# EAGLE schematic jayday (EAGLE 6.2)
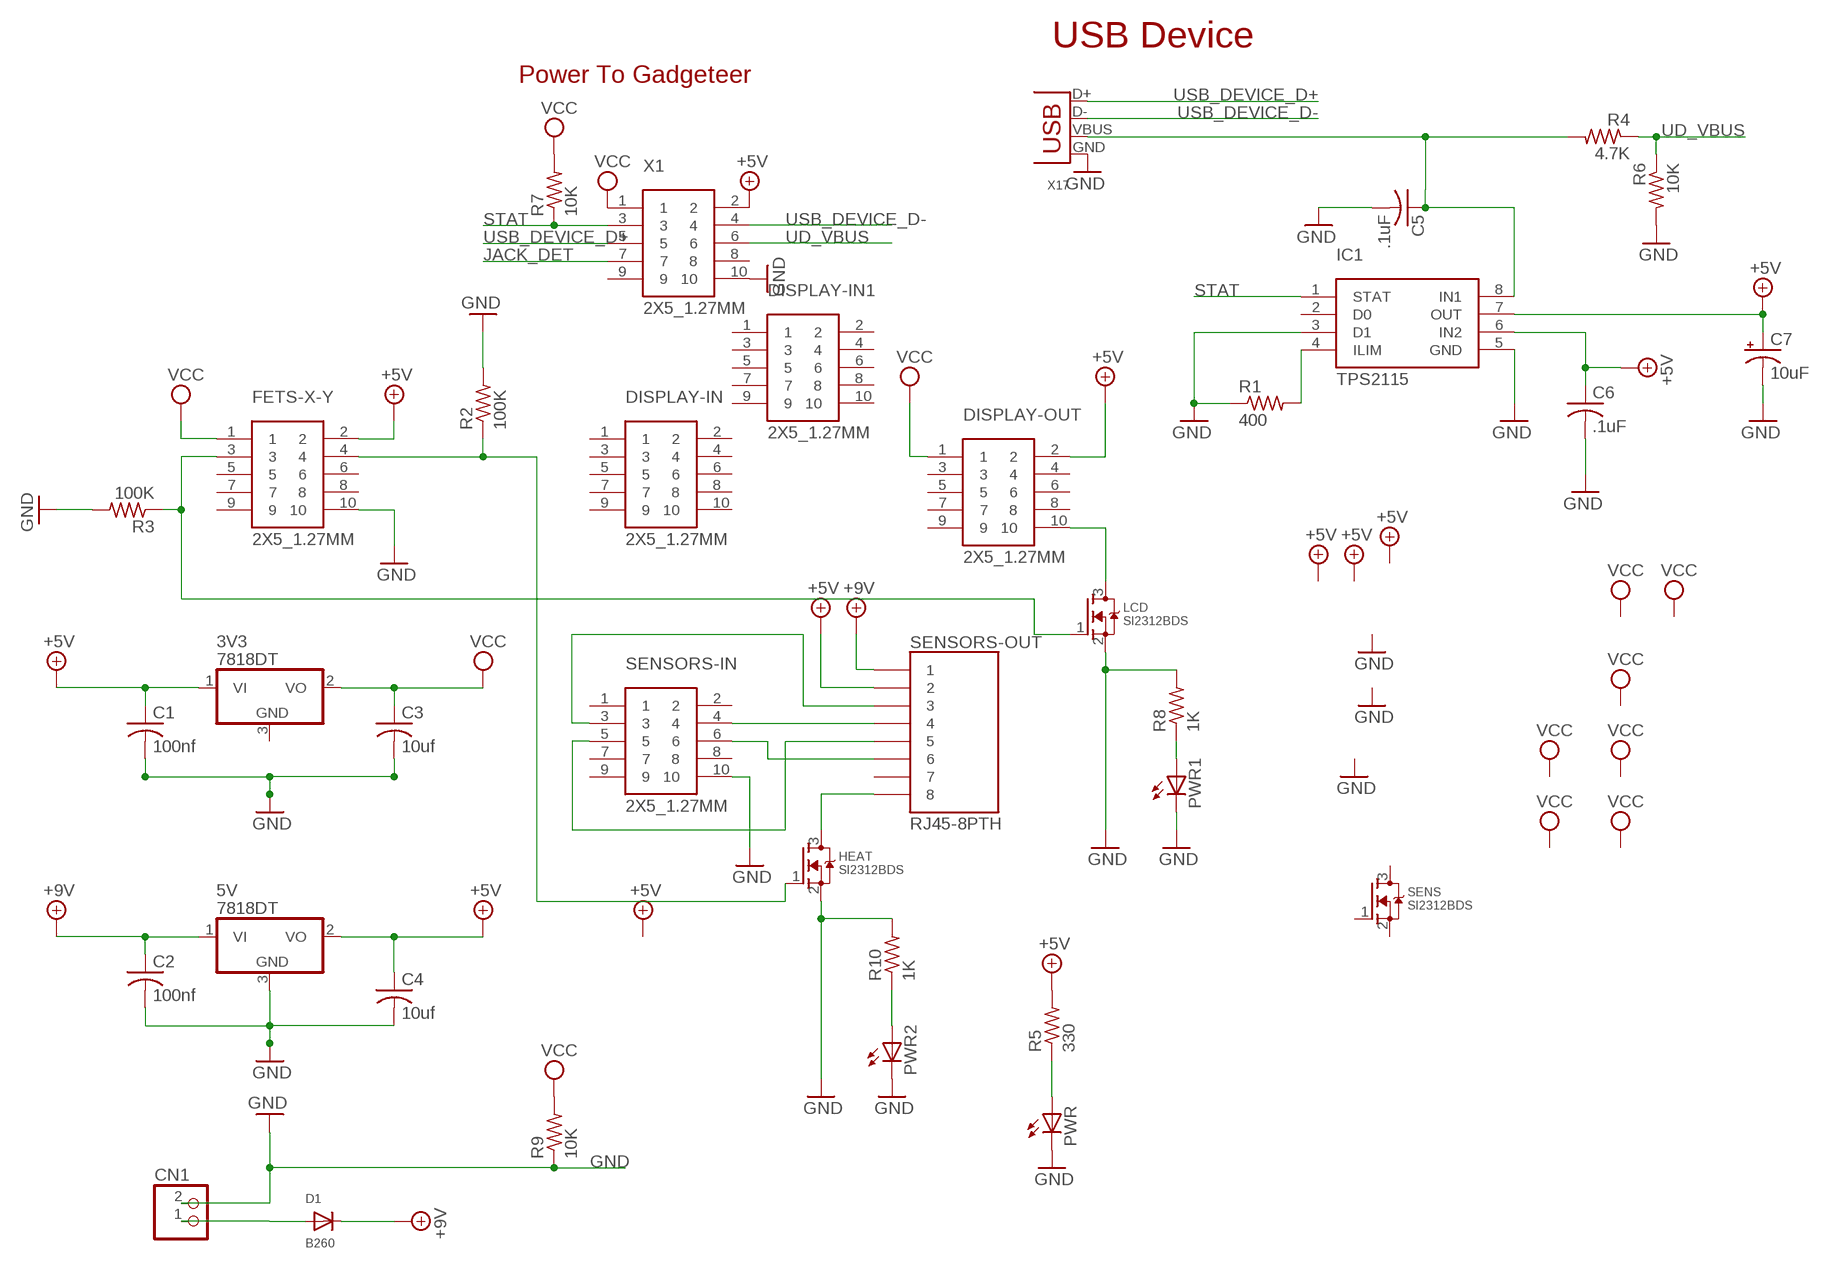
[diagram p0: schematic, sheet 1]

## Parts
3V3  7818DT  [TO252]
5V  7818DT  [TO252]
C1  100nf  C-USC0805  [C0805]
C2  100nf  C-USC0805  [C0805]
C3  10uf  C-USC0805  [C0805]
C4  10uf  C-USC0805  [C0805]
C5  .1uF  C-USC0603K  [C0603K]
C6  .1uF  C-USC0603K  [C0603K]
C7  10uF  CPOL-USCT3528  [CT3528]
CN1  JST_2PIN-THM-RA  [JST-PH-2-THM-RA]
D1  B260  DIODESMA  [SMADIODE]
DISPLAY-IN  2X5_1.27MM  [2X5_1.27MM]
DISPLAY-IN1  2X5_1.27MM  [2X5_1.27MM]
DISPLAY-OUT  2X5_1.27MM  [2X5_1.27MM]
FETS-X-Y  2X5_1.27MM  [2X5_1.27MM]
HEAT  SI2312BDS  [TO-236]
IC1  TPS2115  TSP2115  [TSSOP8]
LCD  SI2312BDS  [TO-236]
PWR  LEDCHIPLED_0805  [CHIPLED_0805]
PWR1  LEDCHIPLED_0805  [CHIPLED_0805]
PWR2  LEDCHIPLED_0805  [CHIPLED_0805]
R1  400  R-US_R0603  [R0603]
R2  100K  R-US_R0603  [R0603]
R3  100K  R-US_R0603  [R0603]
R4  4.7K  R-US_R0603  [R0603]
R5  330  R-US_R0603  [R0603]
R6  10K  R-US_R0603  [R0603]
R7  10K  R-US_R0603  [R0603]
R8  1K  R-US_R0603  [R0603]
R9  10K  R-US_R0603  [R0603]
R10  1K  R-US_R0603  [R0603]
SENS  SI2312BDS  [TO-236]
SENSORS-IN  2X5_1.27MM  [2X5_1.27MM]
SENSORS-OUT  RJ45-8PTH  [RJ45-8]
X1  2X5_1.27MM  [2X5_1.27MM]
X17  DX2R005HN2E700  USB-MB-S  [USB-MB-S]

## Nets
+5V: 3V3.1(VI) 5V.2(VO) C1.1 C4.1 C6.1 C7.+ DISPLAY-OUT.2 FETS-X-Y.2 IC1.6(IN2) IC1.7(OUT) R5.2 SENSORS-OUT.2 X1.2
+9V: 5V.1(VI) C2.1 D1.C SENSORS-OUT.1
GND: 5V.3(GND) C1.2 C2.2 C3.2 C4.2 C5.2 C6.2 C7.- CN1.2 FETS-X-Y.10 HEAT.2(S) IC1.3(D1) IC1.5(GND) LCD.2(S) PWR1.C PWR2.C PWR.C R1.1 R2.2 R3.2 R6.2 R8.2 R9.1 R10.2 SENSORS-IN.10 X1.10 X17.GND
JACK_DET: X1.7
N$1: CN1.1 D1.A
N$2: PWR.A R5.1
N$3: DISPLAY-OUT.10 LCD.3(D)
N$4: HEAT.3(D) SENSORS-OUT.8
N$5: SENSORS-IN.3 SENSORS-OUT.3
N$6: SENSORS-IN.4 SENSORS-OUT.4
N$7: C5.1 IC1.8(IN1) R4.2 X17.VBUS
N$8: IC1.4(ILIM) R1.2
N$9: SENSORS-IN.5 SENSORS-OUT.5
N$10: SENSORS-IN.6 SENSORS-OUT.6
N$11: FETS-X-Y.3 LCD.1(G) R3.1
N$12: FETS-X-Y.4 HEAT.1(G) R2.1
N$13: PWR1.A R8.1
N$14: PWR2.A R10.1
STAT: IC1.1(STAT) R7.1 X1.3
UD_VBUS: R4.1 R6.1 X1.6
USB_DEVICE_D+: X1.5 X17.D+
USB_DEVICE_D-: X1.4 X17.D-
VCC [power]: 3V3.2(VO) C3.1 DISPLAY-OUT.1 FETS-X-Y.1 R7.2 R9.2 X1.1
Unconnected: 3V3.3(GND) DISPLAY-IN1.1 DISPLAY-IN1.2 DISPLAY-IN1.3 DISPLAY-IN1.4 DISPLAY-IN1.5 DISPLAY-IN1.6 DISPLAY-IN1.7 DISPLAY-IN1.8 DISPLAY-IN1.9 DISPLAY-IN1.10 DISPLAY-IN.1 DISPLAY-IN.2 DISPLAY-IN.3 DISPLAY-IN.4 DISPLAY-IN.5 DISPLAY-IN.6 DISPLAY-IN.7 DISPLAY-IN.8 DISPLAY-IN.9 DISPLAY-IN.10 DISPLAY-OUT.3 DISPLAY-OUT.4 DISPLAY-OUT.5 DISPLAY-OUT.6 DISPLAY-OUT.7 DISPLAY-OUT.8 DISPLAY-OUT.9 FETS-X-Y.5 FETS-X-Y.6 FETS-X-Y.7 FETS-X-Y.8 FETS-X-Y.9 IC1.2(D0) SENS.1(G) SENS.2(S) SENS.3(D) SENSORS-IN.1 SENSORS-IN.2 SENSORS-IN.7 SENSORS-IN.8 SENSORS-IN.9 SENSORS-OUT.7 X1.8 X1.9

## Notes on the sheet
- USB Device
- Power To Gadgeteer

## Library data of the parts
3V3 5V = adafruit:78*: Positive VOLTAGE REGULATOR Added bigger pads to the TO-92 package
C1-C4 = adafruit:C-US: CAPACITOR, American symbol
C5 C6 = rcl:C-US: CAPACITOR, American symbol
C7 = rcl:CPOL-US: POLARIZED CAPACITOR, American symbol
CN1 = adafruit:JST_2PIN: JST 2-Pin Connectors of various flavors SMT-RA (S2B-PH-SM4) 4UConnector #17311 SMT (B2B-PH-SM4) THM-RA (S2B-PH) THM (B2B-PH)
D1 = adafruit:DIODE: Diode SMADIODE - SMA Surface Mount Package 20V 1A Schottky Diode Digikey: 641-1014-6-ND DO-1N4148 - Through Hole Small Current Diode SOD-123 20V 1 A (.5mV Vf) Schottky Diode - Digikey: MBRX120TPMSCT-ND SOD-323 10V 570mA (.38mV Vf, 3ns) Schottky Diode - Digikey: ZLLS410CT-ND SOD-523 30V 30mA Schottky Diode (RB751S-40TE61) - Digikey: RB751S-40TE61CT-ND SOT23-R/W - SOT23 Package (R = Solder Paste/Reflow Ovens, W = Hand-Soldering) BAT54Film 40V 300mA - Digikey: 497-7162-1-ND
DISPLAY-IN DISPLAY-IN1 DISPLAY-OUT FETS-X-Y SENSORS-IN X1 = GHI:2X5_1.27MM
HEAT LCD SENS = ozlollc:SI2312BDS
IC1 = GHI:TSP2115
PWR PWR1 PWR2 = led:LED: LED OSRAM: - CHIPLED LG R971, LG N971, LY N971, LG Q971, LY Q971, LO R971, LY R971 LH N974, LH R974 LS Q976, LO Q976, LY Q976 LO Q996 - Hyper CHIPLED LW Q18S LB Q993, LB Q99A, LB R99A - SideLED LS A670, LO A670, LY A670, LG A670, LP A670 LB A673, LV A673, LT A673, LW A673 LH A674 LY A675 LS A676, LA A676, LO A676, LY A676, LW A676 LS A679, LY A679, LG A679 - Hyper Micro SIDELED® LS Y876, LA Y876, LO Y876, LY Y876 LT Y87S - SmartLED LW L88C, LW L88S LB L89C, LB L89S, LG L890 LS L89K, LO L89K, LY L89K LS L896, LA L896, LO L896, LY L896 - TOPLED LS T670, LO T670, LY T670, LG T670, LP T670 LSG T670, LSP T670, LSY T670, LOP T670, LYG T670 LG T671, LOG T671, LSG T671 LB T673, LV T673, LT T673, LW T673 LH T674 LS T676, LA T676, LO T676, LY T676, LB T676, LH T676, LSB T676, LW T676 LB T67C, LV T67C, LT T67C, LS T67K, LO T67K, LY T67K, LW E67C LS E67B, LA E67B, LO E67B, LY E67B, LB E67C, LV E67C, LT E67C LW T67C LS T679, LY T679, LG T679 LS T770, LO T770, LY T770, LG T770, LP T770 LB T773, LV T773, LT T773, LW T773 LH T774 LS E675, LA E675, LY E675, LS T675 LS T776, LA T776, LO T776, LY T776, LB T776 LHGB T686 LT T68C, LB T68C - Hyper Mini TOPLED® LB M676 - Mini TOPLED Santana® LG M470 LS M47K, LO M47K, LY M47K Source: http://www.osram.convergy.de LUXEON: - LUMILED® LXK2-PW12-R00, LXK2-PW12-S00, LXK2-PW14-U00, LXK2-PW14-V00 LXK2-PM12-R00, LXK2-PM12-S00, LXK2-PM14-U00 LXK2-PE12-Q00, LXK2-PE12-R00, LXK2-PE12-S00, LXK2-PE14-T00, LXK2-PE14-U00 LXK2-PB12-K00, LXK2-PB12-L00, LXK2-PB12-M00, LXK2-PB14-N00, LXK2-PB14-P00, LXK2-PB14-Q00 LXK2-PR12-L00, LXK2-PR12-M00, LXK2-PR14-Q00, LXK2-PR14-R00 LXK2-PD12-Q00, LXK2-PD12-R00, LXK2-PD12-S00 LXK2-PH12-R00, LXK2-PH12-S00 LXK2-PL12-P00, LXK2-PL12-Q00, LXK2-PL12-R00 Source: www.luxeon.com KINGBRIGHT: KA-3528ASYC Source: www.kingbright.com
R1-R10 = rcl:R-US_: RESISTOR, American symbol
SENSORS-OUT = SparkFun-Connectors:RJ45-8: RJ45 Jack Simple RJ45, 8-pin connection - connector for common Cat5, Cat5e, and Cat6 Ethernet cables. Footprint not yet proven in production. Connector sku is PRT-00643; Breakout PCB sku is BOB-00716.
X17 = con-usb-3:USB: USB Connectors